# EAGLE schematic card (EAGLE 9.6.2)
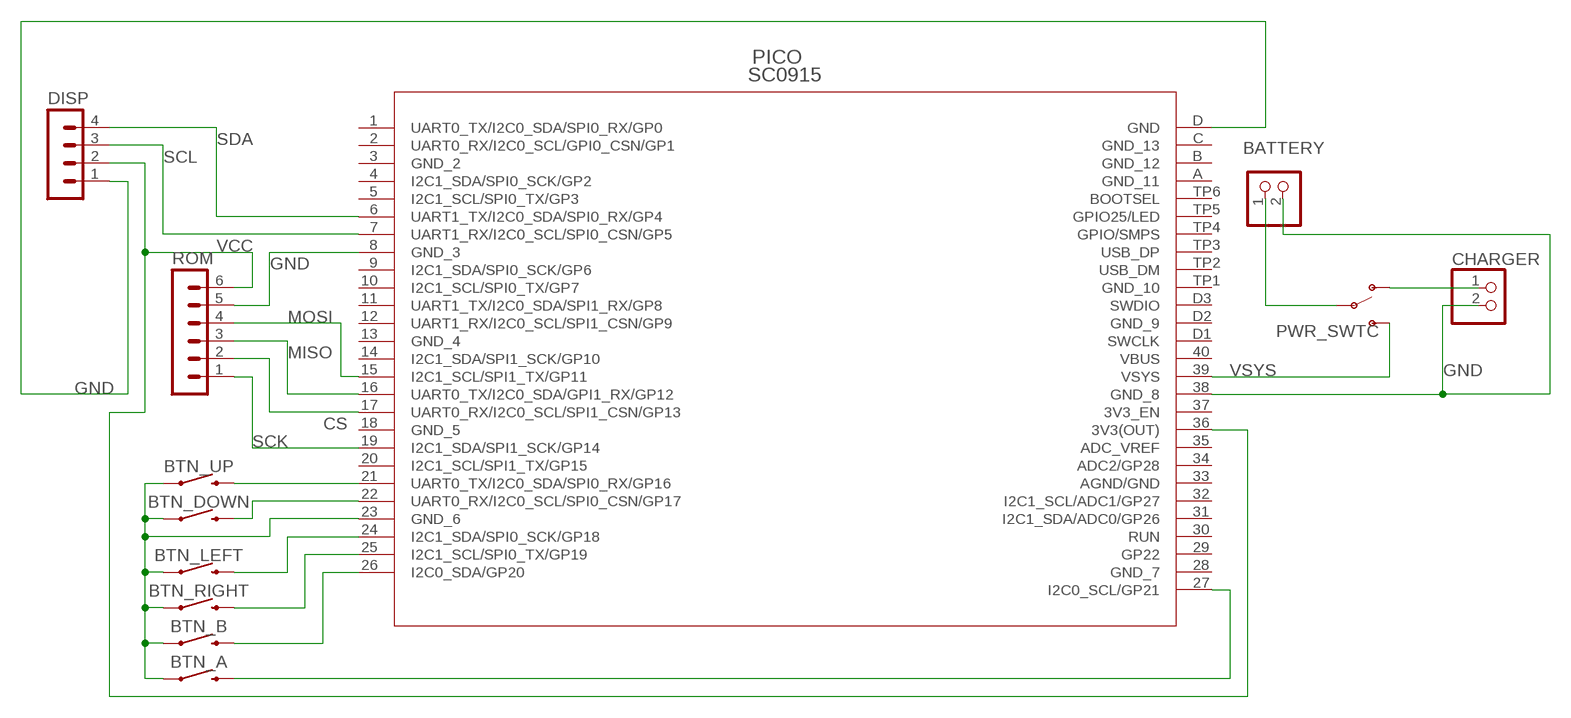
[diagram p0: schematic, sheet 1]

## Parts
BATTERY  PINHD-1X2  [1X02]
BTN_A  MOMENTARY-SWITCH-SPST-PTH-6.0MM  [TACTILE_SWITCH_PTH_6.0MM]
BTN_B  MOMENTARY-SWITCH-SPST-PTH-6.0MM  [TACTILE_SWITCH_PTH_6.0MM]
BTN_DOWN  MOMENTARY-SWITCH-SPST-PTH-6.0MM  [TACTILE_SWITCH_PTH_6.0MM]
BTN_LEFT  MOMENTARY-SWITCH-SPST-PTH-6.0MM  [TACTILE_SWITCH_PTH_6.0MM]
BTN_RIGHT  MOMENTARY-SWITCH-SPST-PTH-6.0MM  [TACTILE_SWITCH_PTH_6.0MM]
BTN_UP  MOMENTARY-SWITCH-SPST-PTH-6.0MM  [TACTILE_SWITCH_PTH_6.0MM]
CHARGER  PINHD-1X2  [1X02]
DISP  MA04-1  [MA04-1]
PICO  SC0915  [SC0915_RPI]
PWR_SWTC  SWITCH-SPDT-PTH-11.6X4.0MM  [SWITCH_SPDT_PTH_11.6X4.0MM]
ROM  MA06-1  [MA06-1]

## Nets
CS: PICO.17(UART0_RX/I2C0_SCL/SPI1_CSN/GP13) ROM.2
GND: BATTERY.2 BTN_A.1 BTN_B.1 BTN_DOWN.1 BTN_LEFT.1 BTN_RIGHT.1 BTN_UP.1 CHARGER.2 DISP.1 PICO.8(GND_3) PICO.23(GND_6) PICO.38(GND_8) PICO.D(GND) ROM.5
MISO: PICO.16(UART0_TX/I2C0_SDA/GPI1_RX/GP12) ROM.3
MOSI: PICO.15(I2C1_SCL/SPI1_TX/GP11) ROM.4
N$1: BTN_UP.3 PICO.21(UART0_TX/I2C0_SDA/SPI0_RX/GP16)
N$2: BTN_DOWN.3 PICO.22(UART0_RX/I2C0_SCL/SPI0_CSN/GP17)
N$3: BTN_LEFT.3 PICO.24(I2C1_SDA/SPI0_SCK/GP18)
N$4: BTN_RIGHT.3 PICO.25(I2C1_SCL/SPI0_TX/GP19)
N$5: BTN_B.3 PICO.26(I2C0_SDA/GP20)
N$6: BTN_A.3 PICO.27(I2C0_SCL/GP21)
N$7: BATTERY.1 PWR_SWTC.2(P)
N$8: CHARGER.1 PWR_SWTC.1(O)
SCK: PICO.19(I2C1_SDA/SPI1_SCK/GP14) ROM.1
SCL: DISP.3 PICO.7(UART1_RX/I2C0_SCL/SPI0_CSN/GP5)
SDA: DISP.4 PICO.6(UART1_TX/I2C0_SDA/SPI0_RX/GP4)
VCC: DISP.2 PICO.36(3V3(OUT)) ROM.6
VSYS: PICO.39(VSYS) PWR_SWTC.3(S)
Unconnected: PICO.1(UART0_TX/I2C0_SDA/SPI0_RX/GP0) PICO.2(UART0_RX/I2C0_SCL/GPI0_CSN/GP1) PICO.3(GND_2) PICO.4(I2C1_SDA/SPI0_SCK/GP2) PICO.5(I2C1_SCL/SPI0_TX/GP3) PICO.9(I2C1_SDA/SPI0_SCK/GP6) PICO.10(I2C1_SCL/SPI0_TX/GP7) PICO.11(UART1_TX/I2C0_SDA/SPI1_RX/GP8) PICO.12(UART1_RX/I2C0_SCL/SPI1_CSN/GP9) PICO.13(GND_4) PICO.14(I2C1_SDA/SPI1_SCK/GP10) PICO.18(GND_5) PICO.20(I2C1_SCL/SPI1_TX/GP15) PICO.28(GND_7) PICO.29(GP22) PICO.30(RUN) PICO.31(I2C1_SDA/ADC0/GP26) PICO.32(I2C1_SCL/ADC1/GP27) PICO.33(AGND/GND) PICO.34(ADC2/GP28) PICO.A(GND_11) PICO.B(GND_12) PICO.C(GND_13) PICO.D1(SWCLK) PICO.D2(GND_9) PICO.D3(SWDIO) PICO.TP1(GND_10) PICO.TP2(USB_DM) PICO.TP3(USB_DP) PICO.TP4(GPIO/SMPS) PICO.TP5(GPIO25/LED) PICO.TP6(BOOTSEL)

## Power pins joined to a net without a drawn wire
3V3_EN: PICO.37(3V3_EN)
ADC_VREF: PICO.35(ADC_VREF)
VBUS: PICO.40(VBUS)

## Library data of the parts
BATTERY CHARGER = pinhead:PINHD-1X2: PIN HEADER
BTN_A BTN_B BTN_DOWN BTN_LEFT BTN_RIGHT BTN_UP = SparkFun-Switches:MOMENTARY-SWITCH-SPST: Momentary Switch (Pushbutton) - SPST Normally-open (NO) SPST momentary switches (buttons, pushbuttons). Variants PTH-12MM - 12mm square, through-hole Momentary Pushbutton Switch - 12mm Square <https://www.sparkfun.com/products/9190> (COM-09190) PTH-6.0MM, PTH-6.0MM-KIT - 6.0mm square, through-hole Mini Pushbutton Switch <https://www.sparkfun.com/products/97> (COM-00097) KIT package intended for soldering kit's - only one side of pads' copper is exposed. PTH-RIGHT-ANGLE-KIT - Right-angle, through-hole Right Angle Tactile Button <https://www.sparkfun.com/products/10791> - Used on SparkFun BigTime Watch Kit <https://www.sparkfun.com/products/11734> SMD-12MM - 12mm square, surface-mount Tactile Button - SMD (12mm) <https://www.sparkfun.com/products/12993> (COM-12993) Used on SparkFun PicoBoard <https://www.sparkfun.com/products/11888> SMD-4.5MM - 4.5mm Square Trackball Switch Used on SparkFun Blackberry Trackballer Breakout <https://www.sparkfun.com/products/13169> SMD-4.6MMX2.8MM - 4.60mm x 2.80mm, surface mount Used on SparkFun SAMD21 Mini Breakout <https://www.sparkfun.com/products/13664> SMD-5.2MM, SMD-5.2-REDUNDANT - 5.2mm square, surface-mount Mini Pushbutton Switch - SMD <https://www.sparkfun.com/products/8720> (COM-08720) Used on Arduino Pro Mini <https://www.sparkfun.com/products/11114> REDUNDANT package connects both switch circuits together SMD-6.0X3.5MM - 6.0 x 3.5mm, surface mount Momentary Reset Switch SMD <https://www.sparkfun.com/products/8229> (COM-08229) SMD-6.2MM-TALL - 6.2mm square, surface mount Tactile Button - SMD (6mm) <https://www.sparkfun.com/products/12992> Used on SparkFun Digital Sandbox <https://www.sparkfun.com/products/12651> SMD-RIGHT-ANGLE - Right-angle, surface mount Used on SparkFun Block for Intel® Edison - Arduino <https://www.sparkfun.com/products/13036>; PROD_ID: SWCH-08441; SF_SKU: COM-00097
DISP = con-lstb:MA04-1: PIN HEADER; OC_FARNELL: unknown; OC_NEWARK: unknown
PICO = pico:SC0915; BUILT_BY: EMA_Cory; COPYRIGHT: Copyright (C) 2018 Accelerated Designs. All rights reserved; DATASHEET: https://datasheets.raspberrypi.org/pico/pico-datasheet.pdf; MANUFACTURER_PART_NUMBER: SC0915; SOURCELIBRARY: Add_to_database_2021-02-03; VENDOR: Raspberry Pi
PWR_SWTC = SparkFun-Switches:SWITCH-SPDT: Single Pole, Double Throw (SPDT) Switch Single-pole, double-throw (SPDT) switch. Variant Overview SMD-AYZ0202 Surface Mount DPDT Switch <https://www.sparkfun.com/products/597> (COM-00597) Used on e.g. LilyPad Arduino USB - ATmega32U4 Board <https://www.sparkfun.com/products/12049> PTH-11.6X4.0MM SPDT Mini Power Switch <https://www.sparkfun.com/products/102> (COM-00102) Used on e.g. SparkFun Simon Says - Through-Hole Soldering Kit <https://www.sparkfun.com/products/10547> (KIT-10547) PTH-11.6X4.0MM-KIT KIT version of SPDT Mini Power Switch - Simplifies soldering by removing tStop of switch pins - only one side can be soldered. PTH-11.6X4.0MM-LOCK LOCK version of SPDT Mini Power Switch - Offset pins hold switch in place for easier soldering. SMD-RIGHT-ANGLE Surface Mount Right Angle Switch <https://www.sparkfun.com/products/10860> (COM-10860) Used on e.g. SparkFun ESP8266 Thing <https://www.sparkfun.com/products/13231>; PROD_ID: SWCH-08261; SF_SKU: COM-00102
ROM = con-lstb:MA06-1: PIN HEADER; OC_FARNELL: unknown; OC_NEWARK: unknown